# EAGLE design cartucho (EAGLE 6.5.0)
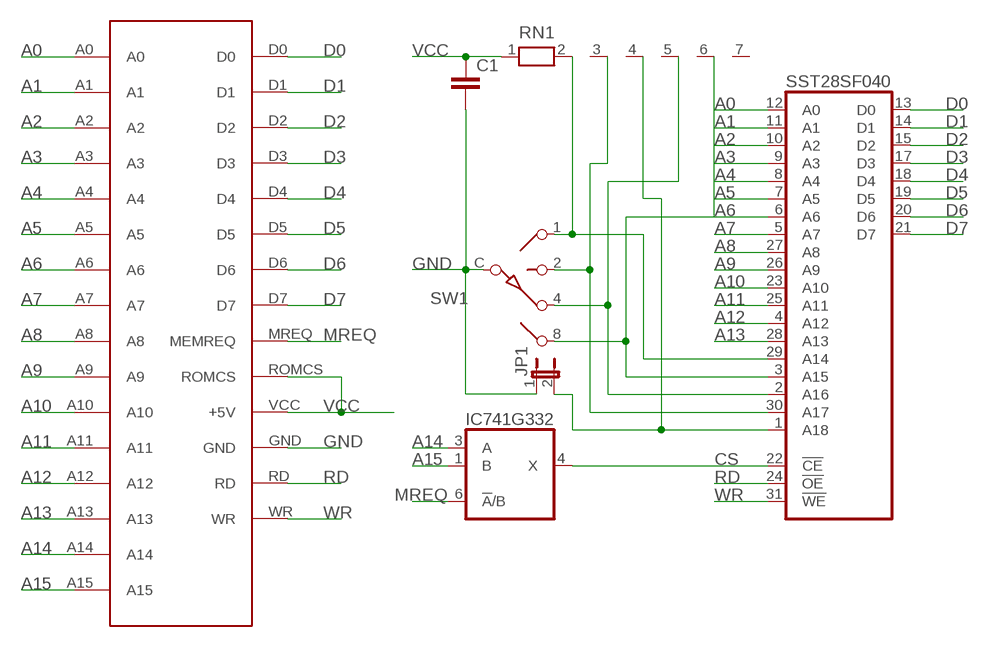
[diagram p0: schematic, sheet 1]

## Parts
C1  C-EUC0603  [C0603]
IC741G332  741G3157DBVR  [DBV_R-PDSO-G6]
JP1  JP1E  [JP1]
RN1  RN06  [RN-7]
SST28SF040  SST39VF040N  [PLCC32R]
SW1  SW-C16  [SW-C16]
U$1  IF2BUS  [BUS_CARTUCHO_IF2]

## Nets
A0: SST28SF040.12(A0) U$1.A0
A1: SST28SF040.11(A1) U$1.A1
A2: SST28SF040.10(A2) U$1.A2
A3: SST28SF040.9(A3) U$1.A3
A4: SST28SF040.8(A4) U$1.A4
A5: SST28SF040.7(A5) U$1.A5
A6: SST28SF040.6(A6) U$1.A6
A7: SST28SF040.5(A7) U$1.A7
A8: SST28SF040.27(A8) U$1.A8
A9: SST28SF040.26(A9) U$1.A9
A10: SST28SF040.23(A10) U$1.A10
A11: SST28SF040.25(A11) U$1.A11
A12: SST28SF040.4(A12) U$1.A12
A13: SST28SF040.28(A13) U$1.A13
A14: IC741G332.3(A) U$1.A14
A15: IC741G332.1(B) U$1.A15
CS: IC741G332.4(X) SST28SF040.22(!CE)
D0: SST28SF040.13(D0) U$1.D0
D1: SST28SF040.14(D1) U$1.D1
D2: SST28SF040.15(D2) U$1.D2
D3: SST28SF040.17(D3) U$1.D3
D4: SST28SF040.18(D4) U$1.D4
D5: SST28SF040.19(D5) U$1.D5
D6: SST28SF040.20(D6) U$1.D6
D7: SST28SF040.21(D7) U$1.D7
GND: C1.2 JP1.1 SW1.C U$1.GND
MREQ: IC741G332.6(!A!/B) U$1.MREQ(MEMREQ)
N$2: JP1.2 RN1.4 SST28SF040.1(A18)
N$3: RN1.3 SST28SF040.30(A17) SW1.2
N$4: RN1.5 SST28SF040.2(A16) SW1.4
N$5: RN1.6 SST28SF040.3(A15) SW1.8
N$6: RN1.2 SST28SF040.29(A14) SW1.1
RD: SST28SF040.24(!OE) U$1.RD
VCC: C1.1 RN1.1 U$1.ROMCS U$1.VCC(+5V)
WR: SST28SF040.31(!WE) U$1.WR
Unconnected: RN1.7

## Power pins joined to a net without a drawn wire
GND: IC741G332.2(GND) SST28SF040.16(GND)
VCC: IC741G332.5(VCC) SST28SF040.32(VCC)

## Library data of the parts
C1 = rcl:C-EU: CAPACITOR, European symbol
IC741G332 = 74xx-little-de:74*1G3157: Single-Pole, Double-Throw Analog Switch Source: http://focus.ti.com/lit/ds/symlink/sn74lvc1g3157.pdf
JP1 = jumper:JP1E: JUMPER
RN1 = resistor-net:RN06: RESISTOR NETWORK; OC_FARNELL: unknown; OC_NEWARK: unknown
SST28SF040 = memory:SST39VF040: 4 Mbit x8 Multi-Purpose Flash Source: http://www.sst.com/dotAsset/40782.pdf
SW1 = special:SW-C16: SWITCH 16-step rotary switch
U$1 = SPECTRUM:IF2BUS

## Board
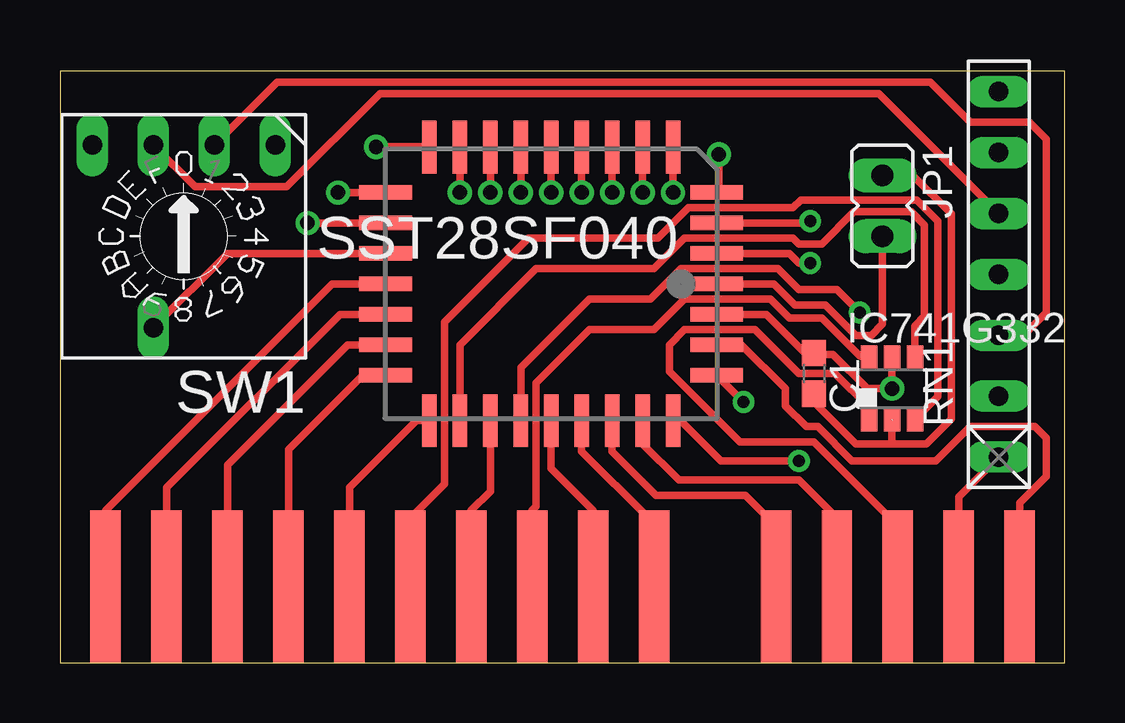
[diagram p1: board, top side]
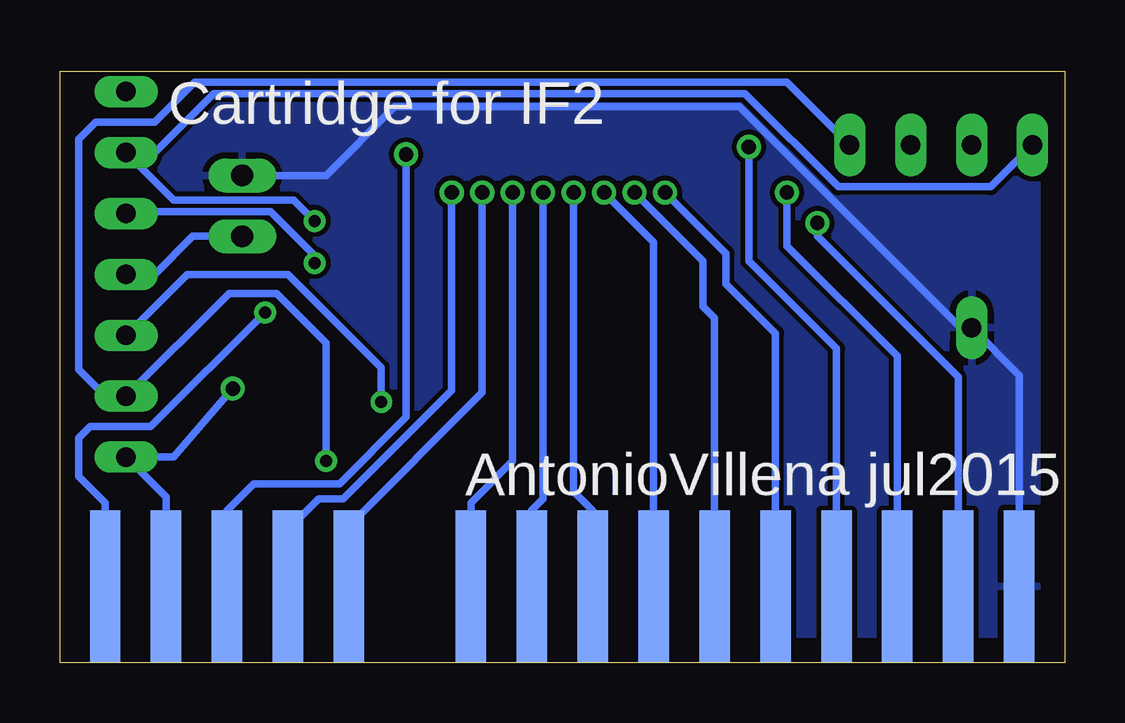
[diagram p2: board, bottom side, seen from below]

Size 41.89 x 24.67 mm. Coordinates in mm from the lower left corner, seen from the top.
Outline: 0,0 41.89,0 41.89,24.67 0,24.67 0,0
Copper layers (1*16): Top 0.035mm / dielectric 1.5mm / Bottom 0.035mm
Design rules "default": minimum track width 10mil, minimum drill 24mil, track to track 8mil, track to pad 8mil, pad to pad 8mil, via to via 8mil, smd to smd 8mil, copper to edge 40mil, drill to drill 8mil, minimum pad ring 10mil, minimum via ring 8mil, stop-mask expansion 4mil, vias tented up to drill 0mil, thermal gap 10mil

### Footprints (pad centres in the part's own frame; a part is rotated, then mirrored left to right if it is on the bottom)
C0603 = smd 1.1 x 1: 1 -0.85,0; 2 0.85,0
DBV_R-PDSO-G6 = smd 0.69 x 0.99: 1 -0.95,-1.29; 2 0,-1.29; 3 0.95,-1.29; 4 0.95,1.3; 5 0,1.3; 6 -0.95,1.3
JP1 = drill 0.914 long: 1 0,-1.27; 2 0,1.27
RN-7 = drill 0.813 long: 1 -7.62,0; 2 -5.08,0; 3 -2.54,0; 4 0,0; 5 2.54,0; 6 5.08,0; 7 7.62,0
PLCC32R = smd 0.6 x 2.2: 1 0,6.9; 2 -1.27,6.9; 3 -2.54,6.9; 4 -3.81,6.9; 14 -3.81,-6.9; 15 -2.54,-6.9; 16 -1.27,-6.9; 17 0,-6.9; 18 1.27,-6.9; 19 2.54,-6.9; 20 3.81,-6.9; 30 3.81,6.9; 31 2.54,6.9; 32 1.27,6.9 | smd 2.2 x 0.6: 5 -5.7,5.08; 6 -5.7,3.81; 7 -5.7,2.54; 8 -5.7,1.27; 9 -5.7,0; 10 -5.7,-1.27; 11 -5.7,-2.54; 12 -5.7,-3.81; 13 -5.7,-5.08; 21 5.7,-5.08; 22 5.7,-3.81; 23 5.7,-2.54; 24 5.7,-1.27; 25 5.7,0; 26 5.7,1.27; 27 5.7,2.54; 28 5.7,3.81; 29 5.7,5.08
SW-C16 = drill 0.813 long: 1 -3.81,-3.81; 2 -1.27,-3.81; 4 1.27,-3.81; 8 3.81,-3.81; C 1.27,3.81
BUS_CARTUCHO_IF2 = smd 1.27 x 6.35 bottom: A0 -27.305,3.175; A1 -24.765,3.175; A2 -22.225,3.175; A3 -19.685,3.175; A4 -17.145,3.175; A5 -14.605,3.175; A6 -9.525,3.175; A7 -6.985,3.175; A12 -4.445,3.175; D0 -29.845,3.175; D1 -32.385,3.175; D2 -34.925,3.175; GND -37.465,3.175; RD 0.635,3.175; ROMCS -1.905,3.175 | smd 1.27 x 6.35: A8 -9.525,3.175; A9 -14.605,3.175; A10 -22.225,3.175; A11 -17.145,3.175; A13 -6.985,3.175; A14 -24.765,3.175; A15 -4.445,3.175; D3 -37.465,3.175; D4 -34.925,3.175; D5 -32.385,3.175; D6 -29.845,3.175; D7 -27.305,3.175; MREQ -19.685,3.175; VCC -1.905,3.175; WR 0.635,3.175

### Placement (x,y rotation side)
C1  31.43,12.06 270 top
IC741G332  34.69,11.43 0 top
JP1  34.29,19.05 180 top
RN1  39.13,16.19 90 top
SST28SF040  20.48,15.8 270 top
SW1  5.16,17.78 180 top
U$1  39.37,0 0 top

### Tracks (layer width: path | path; a pad name or v marks a point on that pad's centre or on a via)
A0  (via drill 0.6)
  Top 0.305: v16.67,19.61 SST28SF040.12
  Bottom 0.305: v16.67,19.61 14.13,17.07 14.13,15.8 12.06,13.73 U$1.A0
A1  (via drill 0.6)
  Top 0.305: v17.94,19.61 SST28SF040.11
  Bottom 0.305: v17.94,19.61 15.08,16.75 15.08,14.84 14.61,14.37 U$1.A1
A2  (via drill 0.6)
  Top 0.305: v19.21,19.61 SST28SF040.10
  Bottom 0.305: U$1.A2 17.14,17.54 v19.21,19.61
A3  (via drill 0.6)
  Top 0.305: SST28SF040.9 v20.48,19.61
  Bottom 0.305: v20.48,19.61 20.48,7.14 19.68,6.35 U$1.A3
A4  (via drill 0.6)
  Top 0.305: v21.75,19.61 SST28SF040.8
  Bottom 0.305: U$1.A4 22.23,6.35 21.75,6.83 v21.75,19.61
A5  (via drill 0.6)
  Top 0.305: v23.02,19.61 SST28SF040.7
  Bottom 0.305: U$1.A5 24.77,6.67 23.02,8.41 v23.02,19.61
A6  (via drill 0.6)
  Top 0.305: v24.29,19.61 SST28SF040.6
  Bottom 0.305: U$1.A6 29.84,5.71 24.29,11.27 v24.29,19.61
A7  (via drill 0.6)
  Top 0.305: v25.56,19.61 SST28SF040.5
  Bottom 0.305: U$1.A7 32.38,5.56 31.11,6.83 30.08,6.83 25.56,11.35 v25.56,19.61
A8
  Top 0.305: SST28SF040.27 23.02,8.81 24.84,6.99 28.57,6.99 29.84,5.71 U$1.A8
A9
  Top 0.305: U$1.A9 24.77,6.03 24.53,6.03 21.75,8.81 SST28SF040.26
A10
  Top 0.305: SST28SF040.23 17.94,7.14 17.14,6.35 U$1.A10
A11
  Top 0.305: U$1.A11 22.23,6.35 20.48,8.1 SST28SF040.25
A12  (via drill 0.6)
  Top 0.305: v27.46,21.19 27.46,19.69 SST28SF040.4
  Bottom 0.305: v27.46,21.19 27.46,10.24 30.24,7.46 33.81,7.46 34.92,6.35 U$1.A12
A13
  Top 0.305: SST28SF040.28 24.29,9.13 25.8,7.62 30.8,7.62 32.38,6.03 U$1.A13
A14
  Top 0.305: U$1.A14 14.61,6.03 16.03,7.46 16.03,14.21 19.53,17.7 24.92,17.7 26.19,18.97 30.56,18.97 30.88,19.29 35.72,19.29 36.59,18.41 36.59,11.1 IC741G332.3
A15
  Top 0.305: 33.74,10.32 IC741G332.1 33.73,10.64 32.31,12.06 30.8,12.06 28.97,13.89 26.04,13.89 25.4,13.26 25.4,12.14 28.34,9.21 31.43,9.21 34.92,5.71 U$1.A15
CS
  Top 0.305: SST28SF040.22 16.67,13.26 19.84,16.43 24.77,16.43 26.04,17.7 30.56,17.7 30.8,17.46 31.75,17.46 33.1,18.81 35.48,18.81 36.04,18.26 36.04,14.45 35.64,14.05 IC741G332.4
D0  (via drill 0.6)
  Top 0.305: v13.18,21.51 15.38,21.51 SST28SF040.13
  Bottom 0.305: U$1.D0 9.53,13.1 13.18,16.75 v13.18,21.51
D1  (via drill 0.6)
  Top 0.305: v11.59,19.61 SST28SF040.14
  Bottom 0.305: U$1.D1 6.99,12.78 11.59,17.38 v11.59,19.61
D2  (via drill 0.6)
  Top 0.305: v10.32,18.34 SST28SF040.15
  Bottom 0.305: U$1.D2 4.45,11.91 10.32,17.78 v10.32,18.34
D3
  Top 0.305: U$1.D3 1.91,6.35 11.35,15.8 SST28SF040.17
D4
  Top 0.305: U$1.D4 4.45,7.3 11.67,14.53 SST28SF040.18
D5
  Top 0.305: U$1.D5 6.99,8.26 11.99,13.26 SST28SF040.19
D6
  Top 0.305: U$1.D6 9.53,8.89 12.62,11.99 SST28SF040.20
D7
  Top 0.305: U$1.D7 12.06,7.3 14.86,10.1 SST28SF040.21
GND
  Top 0.305: JP1.1 35.56,20.32 37.15,18.73 37.15,10.16 36.12,9.13 34.69,9.13 | C1.2 31.49,11.21 31.49,10.82 33.18,9.13 34.69,9.13 | IC741G332.2 34.69,9.13 | SW1.C 6.99,17.07 SST28SF040.16
  Bottom 0.305: U$1.GND 1.91,11.99 SW1.C 4.37,13.97 13.57,23.18 27.94,23.18 30.8,20.32 JP1.1
  pour Bottom: 0.24,24.53 41.67,24.53 41.67,0.16 0.16,0.16 0.16,23.65
MREQ
  Top 0.305: U$1.MREQ 19.68,6.35 19.84,6.51 19.84,11.67 22.07,13.89 24.77,13.89 26.04,15.16 29.61,15.16 30.4,14.37 31.75,14.37 33.34,12.78 33.69,12.78 IC741G332.6
N$2
  Top 0.305: 34.29,17.3 JP1.2 34.29,14.13 33.81,13.65 33.18,13.65 31.91,14.92 30.64,14.92 29.77,15.8 SST28SF040.1
  Bottom 0.305: JP1.2 36.35,17.78 37.94,16.19 RN1.4
N$3  (via drill 0.5)
  Top 0.305: SST28SF040.30 27.62,11.99 27.62,11.75 v28.5,10.87 | RN1.3 40.16,13.65 41.12,14.61 41.12,21.83 40.4,22.54 37.94,22.54 36.27,24.21 9.05,24.21 SW1.2
  Bottom 0.305: v28.5,10.87 28.5,12.3 32.38,16.19 36.59,16.19 RN1.3
N$4  (via drill 0.5)
  Top 0.305: SW1.4 5.64,19.84 9.45,19.84 13.34,23.73 34.13,23.73 RN1.5 | v31.27,16.67 30.8,16.67 30.4,17.07 SST28SF040.2
  Bottom 0.305: v31.27,16.67 31.27,16.99 33.1,18.81 38.97,18.81 39.05,18.73 RN1.5
N$5  (via drill 0.5)
  Top 0.305: 30.96,18.41 v31.27,18.41 31.19,18.34 SST28SF040.3
  Bottom 0.305: v31.27,18.41 32.15,19.29 37.15,19.29 RN1.6 37.94,21.27 35.48,23.73 13.34,23.73 9.45,19.84 3.1,19.84 SW1.8
N$6  (via drill 0.5)
  Top 0.305: SST28SF040.29 25.86,10.1 27.54,8.41 v30.8,8.41
  Bottom 0.305: v30.8,8.41 30.8,13.34 32.86,15.4 34.85,15.4 RN1.2 40.01,11.11 41.12,12.22 41.12,21.83 40.4,22.54 37.94,22.54 36.27,24.21 11.59,24.21 SW1.1
RD  (via drill 0.5)
  Top 0.305: SST28SF040.24 19.21,12.3 22.07,15.16 24.61,15.16 25.88,16.43 29.92,16.43 30.8,15.56 32.38,15.56 v33.34,14.61
  Bottom 0.305: U$1.RD 40.01,6.67 41.12,7.78 41.12,9.37 40.64,9.84 38.1,9.84 v33.34,14.61
VCC  (via drill 0.6)
  Top 0.305: IC741G332.5 v34.69,11.43 33.66,11.43 32.23,12.86 31.49,12.86 C1.1 31.06,12.91 29.45,14.53 SST28SF040.32 | U$1.ROMCS 37.47,6.91 RN1.1
  Bottom 0.305: v34.69,11.43 37.15,8.57 RN1.1 37.47,6.91 U$1.ROMCS
WR
  Top 0.305: U$1.WR 40.01,6.67 41.12,7.78 41.12,9.37 40.64,9.84 37.94,9.84 36.51,8.41 33.02,8.41 31.59,9.84 31.11,9.84 30.24,10.72 30.24,11.43 28.42,13.26 SST28SF040.31

### Text on the board
bPlace: Cartridge for IF2 | AntonioVillena jul2015